# Altium schematic sheet 电设2-NCP1250原理图.SchDoc
size A4
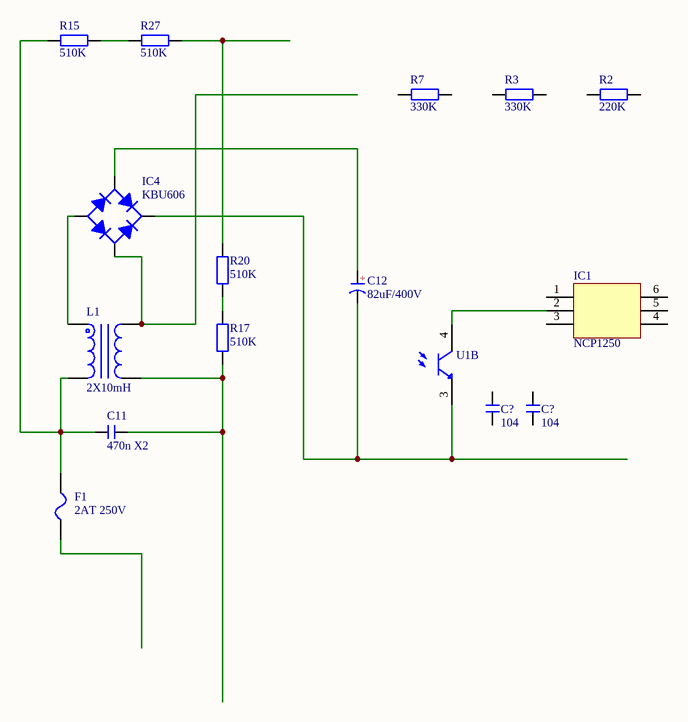
[diagram p0: 电设2-NCP1250原理图.SchDoc]

## Parts
(Parts that share a designator on the sheet are numbered #1, #2 ... from top to bottom, then left to right.)
C11  470n X2  [CX 15*18*11]
C12  82uF/400V  [CAP 7.5*18*35.5 - BK]
C?#1  104  [C 0805_M]
C?#2  104  [C 0805_M]
F1  2AT 250V  [FU 4x16_V]
IC1  NCP1250  [SOP6]
IC4  KBU606  [KBU]
L1  2X10mH  [UU9.8]
R2  220K  [R 1206_M]
R3  330K  [R 1206_M]
R7  330K  [R 1206_M]
R15  510K  [R 1206_M]
R17  510K  [R 1206_M]
R20  510K  [R 1206_M]
R27  510K  [R 1206_M]
U1  (no value)  [DIP-4]  (part B of 2)

## Nets
NetC11_1: C11.1 F1.1 L1.2 R15.1
NetC11_2: C11.2 L1.3 R17.1
NetC12_1: C12.1(A) IC4.AC1
NetC12_2: C12.2(K) IC4.DC+ U1.3
NetIC1_2: IC1.2 U1.4
NetIC4_AC2: IC4.AC2 L1.4
NetIC4_DC-: IC4.DC- L1.1
NetR15_2: R15.2 R27.1
NetR17_2: R17.2 R20.1
NetR20_2: R20.2 R27.2

Not connected (* = marked no-connect by the designer): C?#1 1 2; C?#2 1 2; F1 2; IC1 1 3 4 5 6; R2 1 2; R3 1 2; R7 1 2

## Notes on the sheet
- (in symbol CE) +

## Library data of the parts
C11 = CX: 安规X电容; BOM名称: X电容; 优秀评价可免费更新: 联系淘宝ID：黄晶宝石，获取更新版封装库; 卖家免费技术支持，联系售后: 唯一出售店铺网址https://shop463601444.taobao.com; 本封装库来自淘宝卖家 ID：黄晶宝石: 其他店铺购入均为盗版，请立即申请退款
C12 = CE: 直插电解电容; 优秀评价可免费更新: 联系淘宝ID：黄晶宝石，获取更新版封装库; 卖家免费技术支持，联系售后: 唯一出售店铺网址https://shop463601444.taobao.com; 本封装库来自淘宝卖家 ID：黄晶宝石: 其他店铺购入均为盗版，请立即申请退款; BOM名称: 直插电解电容
C?#1 C?#2 = C: 贴片电容; BOM名称: 无极性贴片电容; 优秀评价可免费更新: 联系淘宝ID：黄晶宝石，获取更新版封装库; 卖家免费技术支持，联系售后: 唯一出售店铺网址https://shop463601444.taobao.com; 本封装库来自淘宝卖家 ID：黄晶宝石: 其他店铺购入均为盗版，请立即申请退款
F1 = FU DIP: 直插保险丝; 版权归属: 封装库来自淘宝卖家 ID：黄晶宝石; 优秀评价可免费更新: 联系淘宝ID：黄晶宝石，获取更新版封装库; 卖家免费技术支持，联系售后: 唯一出售店铺网址https://shop463601444.taobao.com; 封装库来自淘宝卖家 ID：黄晶宝石: 其他店铺购入均为盗版，请立即申请退款; BOM名称: 直插保险丝
IC1 = MP2359: DC降压芯片; 优秀评价可免费更新: 联系淘宝ID：黄晶宝石，获取更新版封装库; 卖家免费技术支持，联系售后: 唯一出售店铺网址https://shop463601444.taobao.com; 封装库来自淘宝卖家 ID：黄晶宝石: 其他店铺购入均为假冒，请立即申请退款，本店奖励2~5元现金; BOM名称: DC降压芯片
IC4 = KBU: 800V/8A整流桥; BOM名称: 1KV/2A整流桥; 卖家免费技术支持，联系售后: 唯一出售店铺网址https://shop463601444.taobao.com; 优秀评价可免费更新: 联系淘宝ID：黄晶宝石，获取更新版封装库; 封装库 来自淘宝卖家 ID：黄晶宝石: 其他店铺购入均为盗版，请立即申请退款
L1 = L-UU: 共模电感; 优秀评价可免费更新: 联系淘宝ID：黄晶宝石，获取更新版封装库; 卖家免费技术支持，联系售后: 唯一出售店铺网址https://shop463601444.taobao.com; 本封装库来自淘宝卖家 ID：黄晶宝石: 其他店铺购入均为盗版，请立即申请退款; BOM名称: 共模电感
R2 R3 R7 R15 R17 R20 R27 = R: 贴片电阻; 优秀评价可免费更新: 联系淘宝ID：黄晶宝石，获取更新版封装库; 卖家免费技术支持，联系售后: 唯一出售店铺网址https://shop463601444.taobao.com; 本封装库来自淘宝卖家 ID：黄晶宝石: 其他店铺购入均为盗版，请立即申请退款; BOM名称: 贴片电阻
U1 = 光耦